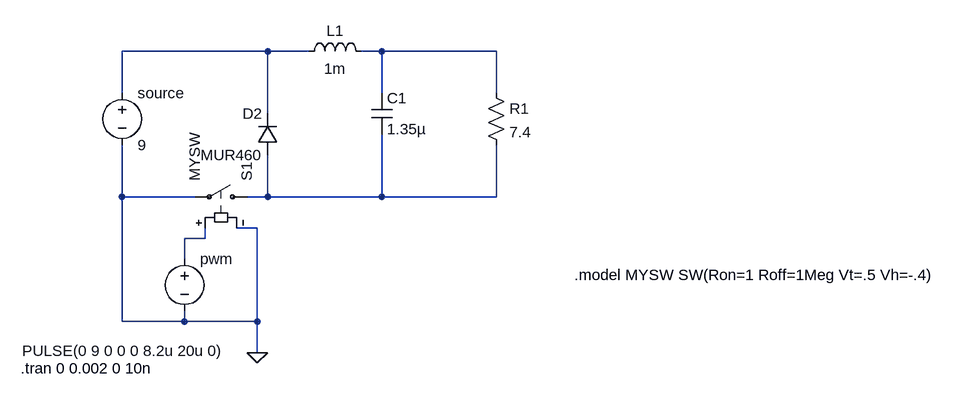
[diagram p0: schematic ej2.asc]
ej2.asc, the LTspice schematic file:
Version 4
SHEET 1 1412 680
WIRE 288 48 64 48
WIRE 352 48 288 48
WIRE 464 48 432 48
WIRE 640 48 464 48
WIRE 64 112 64 48
WIRE 464 112 464 48
WIRE 640 112 640 48
WIRE 288 144 288 48
WIRE 64 272 64 192
WIRE 176 272 64 272
WIRE 288 272 288 208
WIRE 288 272 256 272
WIRE 464 272 464 176
WIRE 464 272 288 272
WIRE 640 272 640 192
WIRE 640 272 464 272
WIRE 272 320 240 320
WIRE 192 336 192 320
WIRE 192 336 160 336
WIRE 160 368 160 336
WIRE 64 464 64 272
WIRE 160 464 160 448
WIRE 160 464 64 464
WIRE 272 464 272 320
WIRE 272 464 160 464
WIRE 272 512 272 464
FLAG 272 512 0
SYMBOL voltage 64 96 R0
SYMATTR InstName source
SYMATTR Value 9
SYMBOL ind 336 64 R270
WINDOW 0 32 56 VTop 2
WINDOW 3 5 56 VBottom 2
SYMATTR InstName L1
SYMATTR Value 1m
SYMBOL cap 448 112 R0
SYMATTR InstName C1
SYMATTR Value 1.35µ
SYMBOL res 624 96 R0
SYMATTR InstName R1
SYMATTR Value 7.4
SYMBOL voltage 160 352 R0
WINDOW 123 0 0 Left 2
WINDOW 39 0 0 Left 2
WINDOW 3 -250 157 Left 2
SYMATTR InstName pwm
SYMATTR Value PULSE(0 9 0 0 0 8.2u 20u 0)
SYMBOL sw 272 272 M270
SYMATTR InstName S1
SYMATTR Value MYSW
SYMBOL diode 304 208 R180
WINDOW 0 24 64 Left 2
WINDOW 3 24 0 Left 2
SYMATTR InstName D2
SYMATTR Value MUR460
TEXT -92 536 Left 2 !.tran 0 0.002 0 10n
TEXT 760 392 Left 2 !.model MYSW SW(Ron=1 Roff=1Meg Vt=.5 Vh=-.4)

The netlist it stands for:
* ej2.asc
V§source N001 0 9
L1 N001 N002 1m
C1 N002 N003 1.35µ
R1 N002 N003 7.4
V§pwm N004 0 PULSE(0 9 0 0 0 8.2u 20u 0)
S1 N003 0 N004 0 MYSW
D2 N003 N001 MUR460
.model D D
.lib standard.dio
.tran 0 0.002 0 10n
.model MYSW SW(Ron=1 Roff=1Meg Vt=.5 Vh=-.4)
.backanno
.end